# EAGLE design shield_v2 (EAGLE 6.5.0)
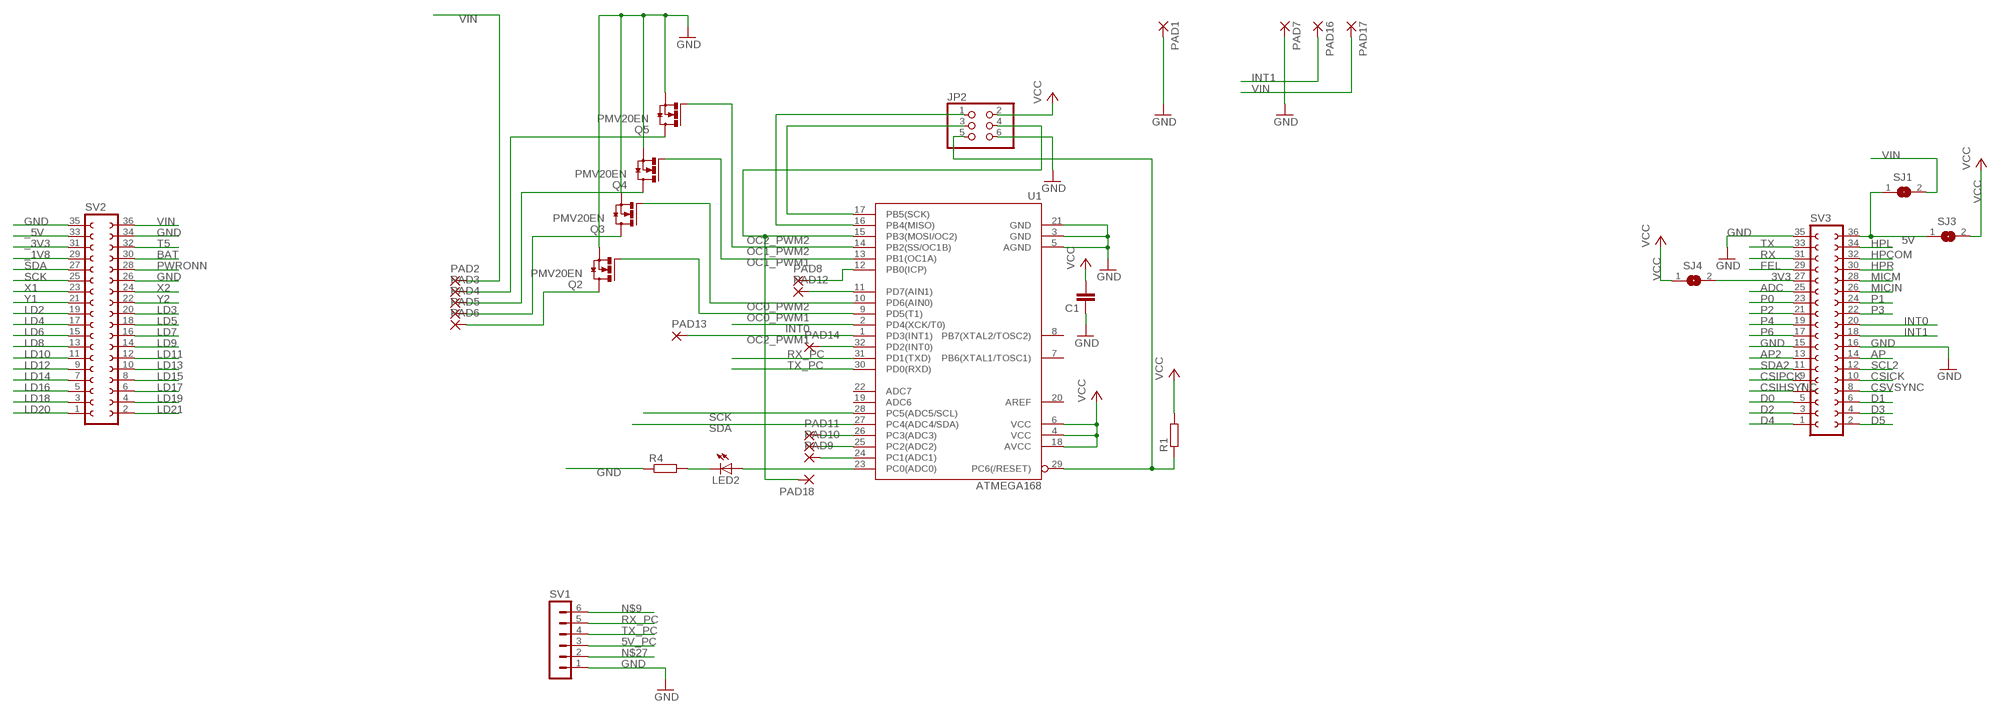
[diagram p0: schematic, sheet 1]

## Parts
C1  C-EUC0805  [C0805]
JP2  PINHD-2X3  [2X03]
LED2  LEDCHIP-LED0805  [CHIP-LED0805]
PAD1  3,17/1,3  [3,17/1,3]
PAD2  3,17/1,3  [3,17/1,3]
PAD3  3,17/1,3  [3,17/1,3]
PAD4  3,17/1,3  [3,17/1,3]
PAD5  3,17/1,3  [3,17/1,3]
PAD6  3,17/1,3  [3,17/1,3]
PAD7  3,17/1,3  [3,17/1,3]
PAD8  SMD5  [SMD2,54-5,08]
PAD9  3,17/1,3  [3,17/1,3]
PAD10  3,17/1,3  [3,17/1,3]
PAD11  3,17/1,3  [3,17/1,3]
PAD12  SMD5  [SMD2,54-5,08]
PAD13  SMD2  [SMD1,27-2,54]
PAD14  3,17/1,3  [3,17/1,3]
PAD16  3,17/1,3  [3,17/1,3]
PAD17  3,17/1,3  [3,17/1,3]
PAD18  3,17/1,3  [3,17/1,3]
Q2  PMV20EN  NMOSFET_SMD_223  [SOT223]
Q3  PMV20EN  NMOSFET_SMD_223  [SOT223]
Q4  PMV20EN  NMOSFET_SMD_223  [SOT223]
Q5  PMV20EN  NMOSFET_SMD_223  [SOT223]
R1  R-EU_M1206  [M1206]
R4  R-EU_M1206  [M1206]
SJ1  SJ  [SJ]
SJ3  SJ  [SJ]
SJ4  SJ  [SJ]
SV1  MA06-1  [MA06-1]
SV2  FE18-2  [FE18-2]
SV3  FE18-2  [FE18-2]
U1  ATMEGA168  [TQFP32-08]

## Nets
3V3: SJ4.2 SV3.27
5V: SJ1.1 SJ3.1 SV3.36
5V_PC: SV1.3
_1V8: SV2.29
_3V3: SV2.31
_5V: SV2.33
ADC: SV3.25
AP: SV3.14
AP2: SV3.13
BAT: SV2.30
CSICK: SV3.10
CSIHSYNC: SV3.7
CSIPCK: SV3.9
CSVSYNC: SV3.8
D1: SV3.6
D2: SV3.3
D3: SV3.4
D4: SV3.1
D5: SV3.2
FEL: SV3.29
GND: C1.1 JP2.6 PAD1.1(P) PAD7.1(P) Q2.3(S) Q3.3(S) Q4.3(S) Q5.3(S) R4.1 SV1.1 SV2.26 SV2.34 SV2.35 SV3.15 SV3.16 SV3.35 U1.3(GND) U1.5(AGND) U1.21(GND)
HPCOM: SV3.32
HPL: SV3.34
HPR: SV3.30
INT0: SV3.20 U1.2(PD4(XCK/T0))
INT1: PAD16.1(P) SV3.18
LD2: SV2.19
LD3: SV2.20
LD4: SV2.17
LD5: SV2.18
LD6: SV2.15
LD7: SV2.16
LD8: SV2.13
LD9: SV2.14
LD10: SV2.11
LD11: SV2.12
LD12: SV2.9
LD13: SV2.10
LD14: SV2.7
LD15: SV2.8
LD16: SV2.5
LD17: SV2.6
LD18: SV2.3
LD19: SV2.4
LD20: SV2.1
LD21: SV2.2
MICIN: SV3.26
MICM: SV3.28
N$1: JP2.5 R1.1 U1.29(PC6(/RESET))
N$2: JP2.1 U1.16(PB4(MISO))
N$3: JP2.3 U1.17(PB5(SCK))
N$4: PAD12.1(P) U1.11(PD7(AIN1))
N$5: PAD6.1(P) Q2.2(D) Q2.4(D)
N$6: PAD5.1(P) Q3.2(D) Q3.4(D)
N$7: PAD4.1(P) Q4.2(D) Q4.4(D)
N$8: PAD3.1(P) Q5.2(D) Q5.4(D)
N$9: SV1.6
N$10: PAD8.1(P) U1.12(PB0(ICP))
N$13: PAD14.1(P) U1.32(PD2(INT0))
N$15: PAD9.1(P) U1.24(PC1(ADC1))
N$16: PAD10.1(P) U1.25(PC2(ADC2))
N$17: PAD11.1(P) U1.26(PC3(ADC3))
N$23: LED2.C R4.2
N$26: LED2.A U1.23(PC0(ADC0))
N$27: SV1.2
OC0_PWM1: Q2.1(G) U1.9(PD5(T1))
OC0_PWM2: Q3.1(G) U1.10(PD6(AIN0))
OC1_PWM1: Q4.1(G) U1.13(PB1(OC1A))
OC1_PWM2: Q5.1(G) U1.14(PB2(SS/OC1B))
OC2_PWM1: PAD13.1(P) U1.1(PD3(INT1))
OC2_PWM2: JP2.4 PAD18.1(P) U1.15(PB3(MOSI/OC2))
P0: SV3.23
P1: SV3.24
P2: SV3.21
P3: SV3.22
P4: SV3.19
P6: SV3.17
PWRONN: SV2.28
RX: SV3.31
RX_PC: SV1.5 U1.31(PD1(TXD))
SCK: SV2.25 U1.28(PC5(ADC5/SCL))
SCL2: SV3.12
SDA: SV2.27 U1.27(PC4(ADC4/SDA))
SDA2: SV3.11
T5: SV2.32
TX: SV3.33
TX_PC: SV1.4 U1.30(PD0(RXD))
VCC: C1.2 JP2.2 R1.2 SJ3.2 SJ4.1 U1.4(VCC) U1.6(VCC) U1.18(AVCC)
VIN: PAD2.1(P) PAD17.1(P) SJ1.2 SV2.36
X1: SV2.23
X2: SV2.24
Y1: SV2.21
Y2: SV2.22
Unconnected: SV3.5 U1.7(PB6(XTAL1/TOSC1)) U1.8(PB7(XTAL2/TOSC2)) U1.19(ADC6) U1.20(AREF) U1.22(ADC7)

## Library data of the parts
C1 = rcl:C-EU: CAPACITOR, European symbol
JP2 = pinhead:PINHD-2X3: PIN HEADER
LED2 = led:LED: LED OSRAM: - CHIPLED LG R971, LG N971, LY N971, LG Q971, LY Q971, LO R971, LY R971 LH N974, LH R974 LS Q976, LO Q976, LY Q976 LO Q996 - Hyper CHIPLED LW Q18S LB Q993, LB Q99A, LB R99A - SideLED LS A670, LO A670, LY A670, LG A670, LP A670 LB A673, LV A673, LT A673, LW A673 LH A674 LY A675 LS A676, LA A676, LO A676, LY A676, LW A676 LS A679, LY A679, LG A679 - Hyper Micro SIDELED® LS Y876, LA Y876, LO Y876, LY Y876 LT Y87S - SmartLED LW L88C, LW L88S LB L89C, LB L89S, LG L890 LS L89K, LO L89K, LY L89K LS L896, LA L896, LO L896, LY L896 - TOPLED LS T670, LO T670, LY T670, LG T670, LP T670 LSG T670, LSP T670, LSY T670, LOP T670, LYG T670 LG T671, LOG T671, LSG T671 LB T673, LV T673, LT T673, LW T673 LH T674 LS T676, LA T676, LO T676, LY T676, LB T676, LH T676, LSB T676, LW T676 LB T67C, LV T67C, LT T67C, LS T67K, LO T67K, LY T67K, LW E67C LS E67B, LA E67B, LO E67B, LY E67B, LB E67C, LV E67C, LT E67C LW T67C LS T679, LY T679, LG T679 LS T770, LO T770, LY T770, LG T770, LP T770 LB T773, LV T773, LT T773, LW T773 LH T774 LS E675, LA E675, LY E675, LS T675 LS T776, LA T776, LO T776, LY T776, LB T776 LHGB T686 LT T68C, LB T68C - Hyper Mini TOPLED® LB M676 - Mini TOPLED Santana® LG M470 LS M47K, LO M47K, LY M47K Source: http://www.osram.convergy.de LUXEON: - LUMILED® LXK2-PW12-R00, LXK2-PW12-S00, LXK2-PW14-U00, LXK2-PW14-V00 LXK2-PM12-R00, LXK2-PM12-S00, LXK2-PM14-U00 LXK2-PE12-Q00, LXK2-PE12-R00, LXK2-PE12-S00, LXK2-PE14-T00, LXK2-PE14-U00 LXK2-PB12-K00, LXK2-PB12-L00, LXK2-PB12-M00, LXK2-PB14-N00, LXK2-PB14-P00, LXK2-PB14-Q00 LXK2-PR12-L00, LXK2-PR12-M00, LXK2-PR14-Q00, LXK2-PR14-R00 LXK2-PD12-Q00, LXK2-PD12-R00, LXK2-PD12-S00 LXK2-PH12-R00, LXK2-PH12-S00 LXK2-PL12-P00, LXK2-PL12-Q00, LXK2-PL12-R00 Source: www.luxeon.com KINGBRIGHT: KA-3528ASYC Source: www.kingbright.com
PAD1-PAD7 PAD9-PAD11 PAD14 PAD16-PAD18 = wirepad:3,17/1,3: THROUGH-HOLE PAD
PAD8 PAD12 = wirepad:SMD5: SMD PAD
PAD13 = wirepad:SMD2: SMD PAD
Q2-Q5 = transistor-power:NMOSFET_SMD_223
R1 R4 = rcl:R-EU_: RESISTOR, European symbol
SJ1 SJ3 SJ4 = jumper:SJ: SMD solder JUMPER
SV1 = con-lstb:MA06-1: PIN HEADER; OC_FARNELL: unknown; OC_NEWARK: unknown
SV2 SV3 = con-lsta:FE18-2: FEMALE HEADER; OC_FARNELL: unknown; OC_NEWARK: unknown
U1 = SparkFun-DigitalIC:ATMEGA168: Atmel 32-pin 8-bit micro, 16k flash.

## Board
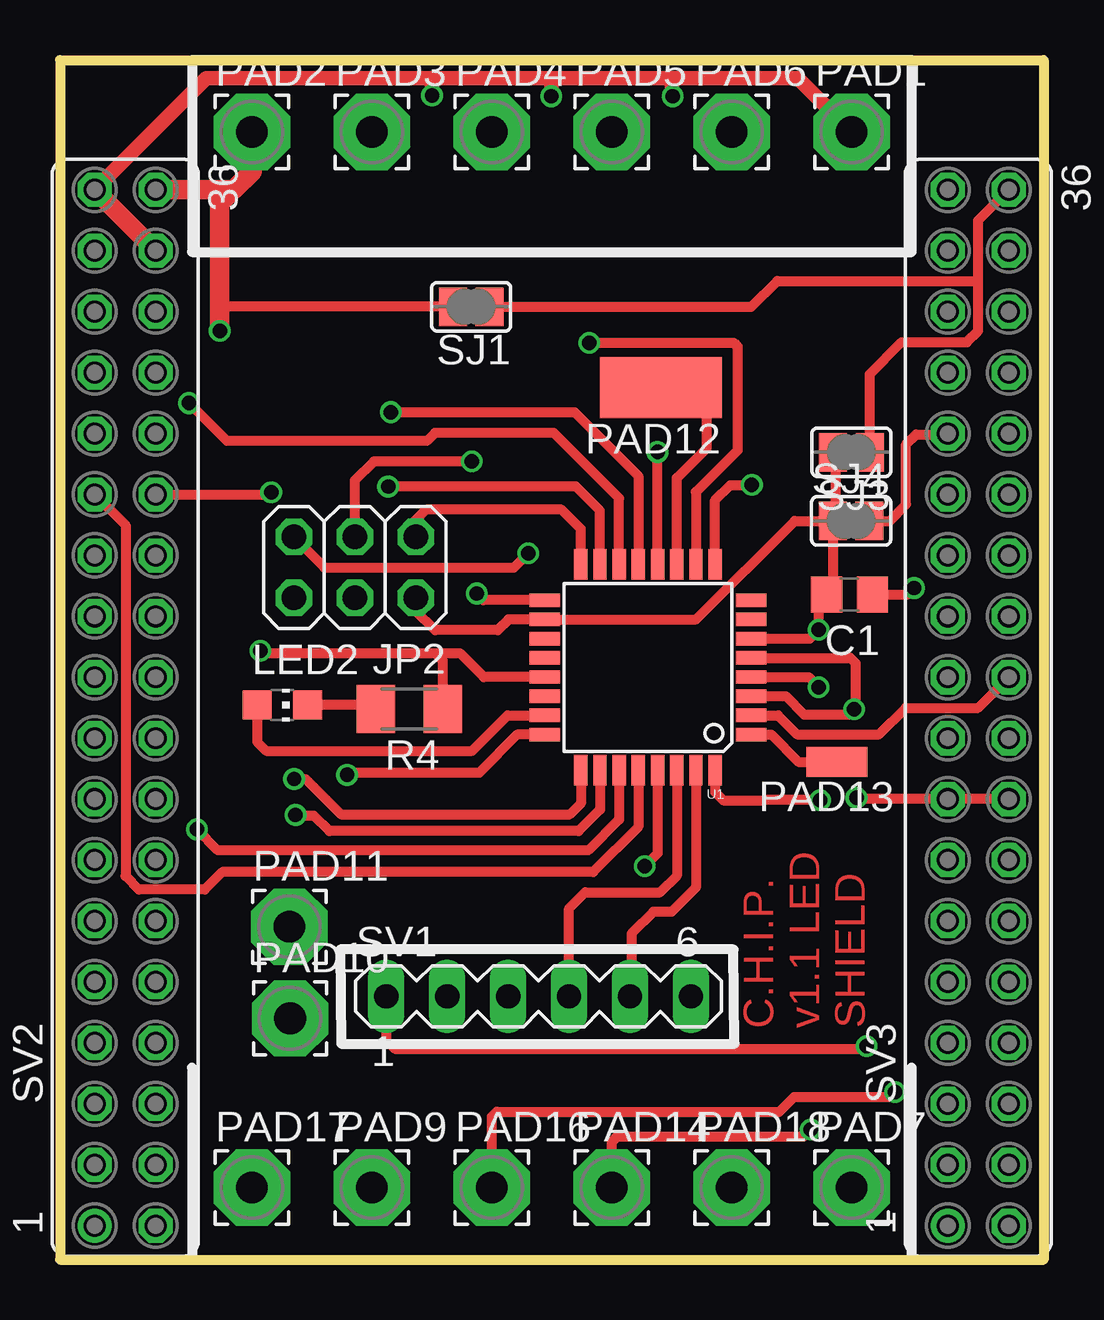
[diagram p1: board, top side]
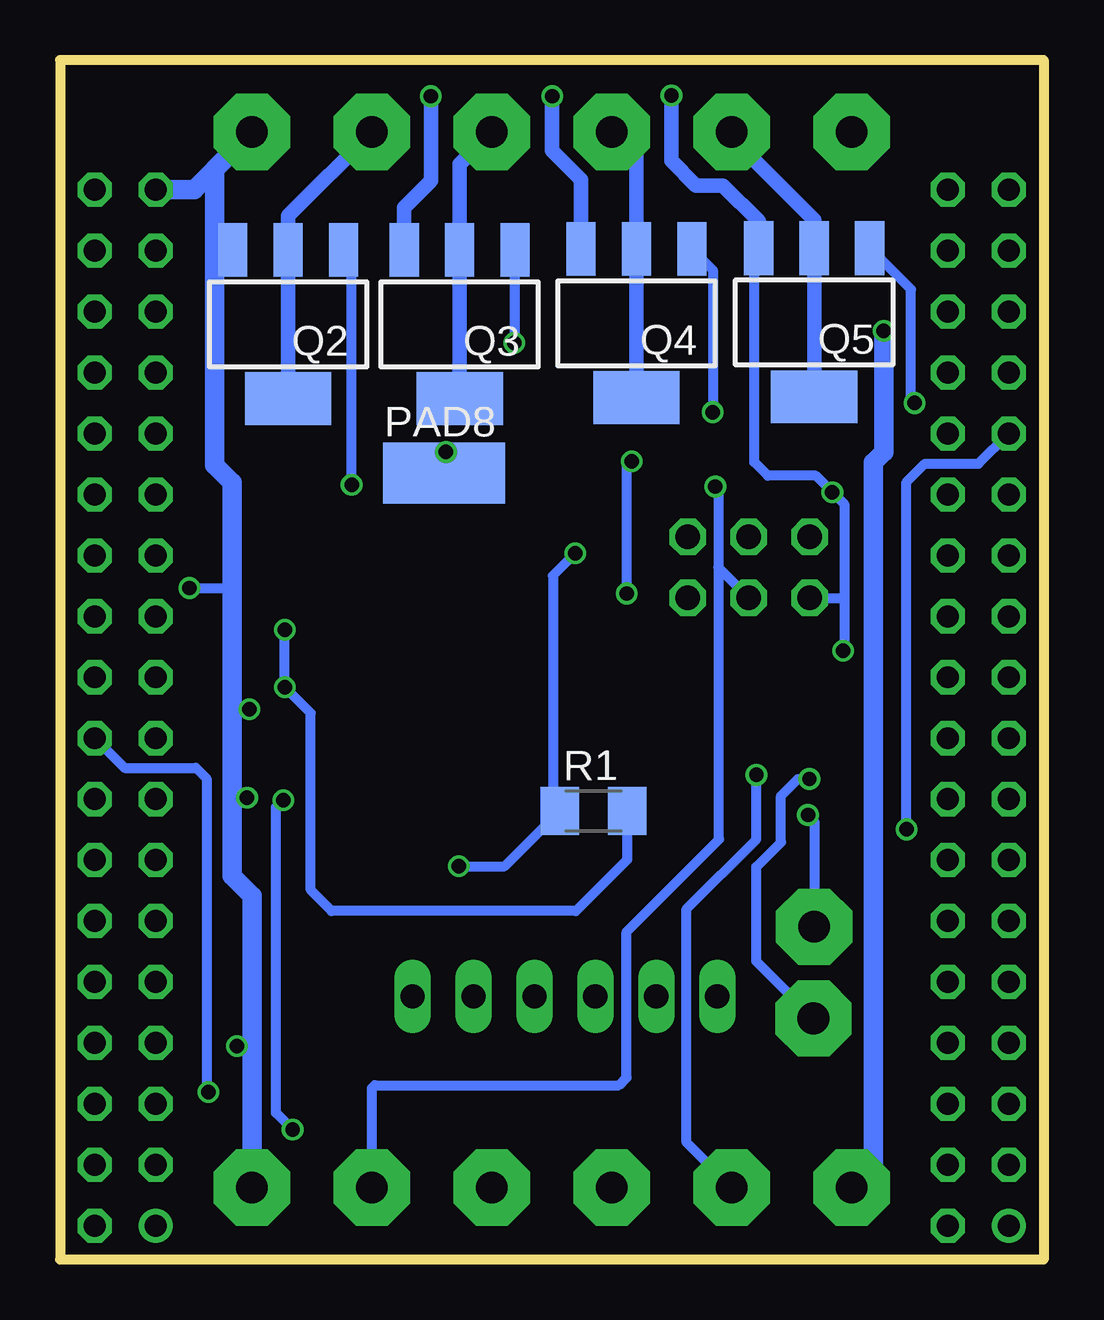
[diagram p2: board, bottom side, seen from below]

Size 41 x 50 mm. Coordinates in mm from the lower left corner, seen from the top.
Outline: 0,50 41,50 41,0 0,0 0,50
Copper layers (1*16): Top 0.035mm / dielectric 1.5mm / Bottom 0.035mm
Design rules "SeeedStudio_2layer_DRU_no_angle_20140221": minimum track width 6mil, minimum drill 12mil, track to track 6mil, track to pad 6mil, pad to pad 6mil, via to via 6mil, smd to smd 0mil, copper to edge 10mil, drill to drill 10mil, minimum pad ring 10mil, minimum via ring 6mil, stop-mask expansion 2mil, vias tented up to drill 100mil, thermal gap 10mil
tRestrict: area 21.3,21.5 to 27.7,26.1

### Footprints (pad centres in the part's own frame; a part is rotated, then mirrored left to right if it is on the bottom)
C0805 = smd 1.3 x 1.5: 1 -0.95,0; 2 0.95,0
2X03 = drill 1.016 octagon: 1 -2.54,-1.27; 2 -2.54,1.27; 3 0,-1.27; 4 0,1.27; 5 2.54,-1.27; 6 2.54,1.27
CHIP-LED0805 = smd 1.2 x 1.2: A 0,-1.05; C 0,1.05
3,17/1,3 = drill 1.321 pad 3.175 octagon: 1 0,0
SMD2,54-5,08 = smd 2.54 x 5.08: 1 0,0
SMD1,27-2,54 = smd 1.27 x 2.54: 1 0,0
SOT223 = smd 1.219 x 2.235: 1 -2.311,-3.099; 2 0,-3.099; 3 2.311,-3.099 | smd 3.6 x 2.2: 4 0,3.099
M1206 = smd 1.6 x 2: 1 -1.4,0; 2 1.4,0
SJ = smd 1.168 x 1.6: 1 -0.762,0; 2 0.762,0
MA06-1 = drill 1.016 long: 1 -6.35,0; 2 -3.81,0; 3 -1.27,0; 4 1.27,0; 5 3.81,0; 6 6.35,0
FE18-2 = drill 0.914: 1 -21.59,1.27 | drill 0.914 octagon: 2 -21.59,-1.27; 3 -19.05,1.27; 4 -19.05,-1.27; 5 -16.51,1.27; 6 -16.51,-1.27; 7 -13.97,1.27; 8 -13.97,-1.27; 9 -11.43,1.27; 10 -11.43,-1.27; 11 -8.89,1.27; 12 -8.89,-1.27; 13 -6.35,1.27; 14 -6.35,-1.27; 15 -3.81,1.27; 16 -3.81,-1.27; 17 -1.27,1.27; 18 -1.27,-1.27; 19 1.27,1.27; 20 1.27,-1.27; 21 3.81,1.27; 22 3.81,-1.27; 23 6.35,1.27; 24 6.35,-1.27; 25 8.89,1.27; 26 8.89,-1.27; 27 11.43,1.27; 28 11.43,-1.27; 29 13.97,1.27; 30 13.97,-1.27; 31 16.51,1.27; 32 16.51,-1.27; 33 19.05,1.27; 34 19.05,-1.27; 35 21.59,1.27; 36 21.59,-1.27
TQFP32-08 = smd 1.27 x 0.559: 1 -4.293,2.8; 2 -4.293,2; 3 -4.293,1.2; 4 -4.293,0.4; 5 -4.293,-0.4; 6 -4.293,-1.2; 7 -4.293,-2; 8 -4.293,-2.8; 17 4.293,-2.8; 18 4.293,-2; 19 4.293,-1.2; 20 4.293,-0.4; 21 4.293,0.4; 22 4.293,1.2; 23 4.293,2; 24 4.293,2.8 | smd 0.559 x 1.27: 9 -2.8,-4.293; 10 -2,-4.293; 11 -1.2,-4.293; 12 -0.4,-4.293; 13 0.4,-4.293; 14 1.2,-4.293; 15 2,-4.293; 16 2.8,-4.293; 25 2.8,4.293; 26 2,4.293; 27 1.2,4.293; 28 0.4,4.293; 29 -0.4,4.293; 30 -1.2,4.293; 31 -2,4.293; 32 -2.8,4.293

### Placement (x,y rotation side)
C1  32.91,27.72 180 top
JP2  12.29,28.85 180 top
LED2  9.27,23.11 270 top
PAD1  33,47 0 top
PAD2  8,47 0 top
PAD3  13,47 0 top
PAD4  18,47 0 top
PAD5  23,47 0 top
PAD6  28,47 0 top
PAD7  33,3 0 top
PAD8  24.99,32.79 270 bottom
PAD9  13,3 0 top
PAD10  9.59,10.05 0 top
PAD11  9.56,13.87 0 top
PAD12  25.06,36.35 90 top
PAD13  32.39,20.74 90 top
PAD14  23,3 0 top
PAD16  18,3 0 top
PAD17  8,3 0 top
PAD18  28,3 0 top
Q2  31.49,38.98 180 bottom
Q3  24.34,38.98 180 bottom
Q4  16.97,39.02 180 bottom
Q5  9.56,39.06 180 bottom
R1  18.76,18.7 0 bottom
R4  14.56,22.95 180 top
SJ1  17.14,39.71 180 top
SJ3  32.99,33.65 180 top
SJ4  32.98,30.79 0 top
SV1  19.95,10.97 0 top
SV2  2.72,23 90 top
SV3  38.28,23 90 top
U1  24.51,24.68 180 top

### Tracks (layer width: path | path; a pad name or v marks a point on that pad's centre or on a via)
3V3
  Top 0.406: SJ4.2 34.59,30.79 35.27,31.47 35.27,33.97 35.69,34.39 36.97,34.39 SV3.27
5V
  Top 0.406: SJ3.1 33.75,36.9 35.08,38.23 37.81,38.23 38.28,38.7 38.28,40.8 | 38.28,40.8 38.28,43.32 SV3.36 | SJ1.1 28.82,39.71 29.9,40.79 38.27,40.79 arc90 38.28,40.8
GND  (via drill 0.6)
  Top 0.406: U1.21 17.67,24.28 16.67,25.28 15.63,25.28 | U1.3 30.25,23.48 31.02,22.71 32.87,22.71 v33.1,22.94 33.16,23 33.16,24.86 32.94,25.08 U1.5 | SV1.1 13.6,9.14 13.95,8.79 33.52,8.79 v33.63,8.9 | 15.63,25.28 8.46,25.28 v8.36,25.38 | R4.1 15.96,24.95 15.63,25.28 | SV2.26 8.71,31.89 v8.8,31.98 | SV3.16 SV3.15 33.26,19.19 v33.2,19.25 | C1.1 35.34,27.72 v35.61,27.99
  Top 0.61: SV2.35 6.09,49.23 15.51,49.23 | 15.51,49.23 20.46,49.23 | 20.46,49.23 25.51,49.23 | 25.51,49.23 30.77,49.23 PAD1.1 | v25.54,48.49 25.51,48.52 25.51,49.23 | v20.48,48.49 20.48,49.21 20.46,49.23 | v15.51,48.52 15.51,49.23
  Top 0.813: SV2.35 SV2.34
  Bottom 0.406: 33.81,24.19 33.82,24.18 | v33.1,22.94 33.82,22.94 | v33.63,8.9 33.03,8.9 33,8.93 | JP2.6 8.4,27.58 8.36,27.54 8.31,27.54 | Q5.3 12.06,41.97 12.06,33.23 11.5,32.67 9.49,32.67 v8.8,31.98 8.31,31.49 8.31,27.54 | 34.53,39.14 34.56,39.11 | v33.2,19.25 33.79,19.25 33.82,19.28 | v35.61,27.99 33.99,27.99 33.82,28.16 | 8.31,27.54 8.31,25.43 v8.36,25.38
  Bottom 0.61: Q3.3 26.65,43.85 25.54,44.96 v25.54,48.49 | Q4.3 19.28,45.01 20.49,46.22 v20.49,48.48 v20.48,48.49 | Q5.3 11.87,43.28 13.36,44.77 14.48,44.77 15.51,45.8 v15.51,48.52
  Bottom 0.813: PAD7.1 33,8.93 33,15.16 33.82,15.98 33.82,19.28 33.82,22.94 33.82,24.18 33.82,28.16 33.82,32.38 34.56,33.12 34.56,39.11 34.56,42.21 | 34.56,42.21 34.56,45.44 | 34.56,45.44 PAD1.1 | Q2.3 34.43,42.08 34.56,42.21 | 34.56,45.44 35.41,44.59 SV3.35
INT0
  Top 0.406: U1.2 29.93,22.68 30.72,21.89 34.14,21.89 35.25,23 38.28,23 SV3.20
INT1  (via drill 0.6)
  Top 0.406: PAD16.1 18,5.96 18.2,6.16 29.99,6.16 30.61,6.78 34.61,6.78 v34.81,6.98
  Bottom 0.406: 34.9,7.07 v34.81,6.98 34.89,7.06 34.89,20.05 35.33,20.49 38.31,20.49 SV3.18
N$1  (via drill 0.6)
  Top 0.406: JP2.5 11.03,28.84 18.92,28.84 v19.52,29.44 | U1.29 24.91,16.93 v24.37,16.39
  Bottom 0.406: v19.52,29.44 20.45,28.51 20.45,18.99 R1.1 | 21.02,17.84 R1.1 | R1.1 22.47,16.39 v24.37,16.39
N$2
  Top 0.406: U1.16 21.71,30.45 20.9,31.26 15.26,31.26 14.72,30.72 14.72,30.23 JP2.1
N$3  (via drill 0.6)
  Top 0.406: U1.17 17.65,27.48 v17.37,27.76 | v17.17,33.27 13.09,33.27 12.29,32.47 JP2.3
  Bottom 0.406: v17.37,27.76 17.37,33.07 v17.17,33.27
N$4
  Top 0.406: U1.11 25.71,32.58 26.96,33.83 26.96,36.2 26.84,36.32 25.09,36.32 PAD12.1
N$5
  Bottom 0.61: PAD6.1 31.49,43.51 Q2.2 Q2.4
N$6
  Bottom 0.61: PAD5.1 24.34,45.66 Q3.2 Q3.4
N$7
  Bottom 0.61: Q4.4 Q4.2 16.97,45.97 PAD4.1
N$8
  Bottom 0.61: Q5.4 Q5.2 9.56,43.33 13,46.77 PAD3.1
N$10  (via drill 0.6)
  Top 0.406: U1.12 v24.91,33.66
  Bottom 0.152: 25.3,33.12 25.4,33.02 PAD8.1
  Bottom 0.406: 25.41,33.23 25.3,33.12 24.99,32.81 v24.91,33.66 24.89,32.89 24.89,32.92 25.34,33.37
N$13  (via drill 0.6)
  Top 0.406: U1.32 27.31,19.48 27.65,19.14 29.34,19.14 29.36,19.16 29.37,19.15 v31.69,19.15 | PAD14.1 23,4.91 23.22,5.13 31.01,5.13 v31.3,5.42
  Bottom 0.406: v31.3,5.42 31.99,6.11 31.99,18.85 v31.69,19.15
N$15  (via drill 0.6)
  Top 0.406: U1.24 19.06,21.88 17.47,20.29 12.06,20.29 v11.97,20.2
  Bottom 0.406: 12.05,20.12 v11.97,20.2 11.97,17.52 14.88,14.61 14.88,4.88 PAD9.1
N$16  (via drill 0.6)
  Top 0.406: U1.25 21.71,19.02 21.25,18.56 11.71,18.56 10.24,20.03 v9.76,20.03
  Bottom 0.406: PAD10.1 11.97,12.43 11.97,16.37 10.95,17.39 10.95,19.32 10.24,20.03 v9.76,20.03
N$17  (via drill 0.6)
  Top 0.406: U1.26 22.52,20.38 22.52,18.76 21.62,17.86 11.23,17.86 10.59,18.5 9.85,18.5 v9.82,18.53
  Bottom 0.406: v9.82,18.53 9.56,18.27 PAD11.1
N$23
  Top 0.406: R4.2 13,23.11 LED2.C
N$26
  Top 0.406: LED2.A 8.22,21.58 8.6,21.2 17.18,21.2 18.66,22.68 U1.23
OC0_PWM1  (via drill 0.6)
  Top 0.406: U1.9 27.31,31.65 27.94,32.28 v28.83,32.28 v28.84,32.29
  Bottom 0.406: v28.84,32.29 28.84,41.74 Q2.1
OC0_PWM2  (via drill 0.6)
  Top 0.406: U1.10 26.51,31.99 28.24,33.72 28.24,38.06 28.09,38.21 v22.06,38.21
  Bottom 0.406: Q3.1 22.06,42.05 v22.06,38.21
OC1_PWM1  (via drill 0.6)
  Top 0.406: v13.79,35.32 21.45,35.32 24.11,32.66 U1.13
  Bottom 0.406: Q4.1 13.79,41.25 v13.79,35.32
OC1_PWM2  (via drill 0.6)
  Top 0.406: U1.14 23.31,31.73 20.59,34.45 15.63,34.45 15.3,34.12 6.96,34.12 v5.38,35.7
  Bottom 0.406: v5.38,35.7 5.53,35.85 5.53,40.44 Q5.1
OC2_PWM1
  Top 0.406: U1.1 29.65,21.88 30.79,20.74 PAD13.1
OC2_PWM2  (via drill 0.6)
  Top 0.406: U1.15 22.51,31.21 21.5,32.22 v13.68,32.22
  Bottom 0.406: v13.68,32.22 13.56,32.1 13.56,28.85 13.53,28.82 | 13.53,28.82 JP2.4 | PAD18.1 28,7.15 27.88,7.27 17.7,7.27 17.38,7.59 17.38,13.66 13.53,17.52 13.53,28.82
RX_PC
  Top 0.406: SV1.5 23.83,11.04 23.83,13.59 24.73,14.49 25.49,14.49 26.51,15.51 U1.31
SCK
  Top 0.406: SV2.25 2.73,30.61 2.73,15.98 3.29,15.42 6.04,15.42 6.77,16.15 22.22,16.15 24.11,18.04 U1.28
SDA  (via drill 0.6)
  Top 0.406: U1.27 23.31,18.34 22.03,17.06 6.58,17.06 v5.71,17.93
  Bottom 0.406: v5.71,17.93 5.71,32.4 4.94,33.17 2.71,33.17 SV2.27
TX_PC
  Top 0.406: U1.30 25.71,16 25.02,15.31 21.89,15.31 21.22,14.64 SV1.4
VCC  (via drill 0.6)
  Top 0.406: U1.4 31.21,24.28 v31.63,23.86 | 32.34,30.17 32.34,33.54 SJ3.2 | SJ4.1 32.34,30.17 | 32.34,30.17 32.32,30.15 | U1.6 31.26,25.88 v31.63,26.25 31.63,27.31 | SJ4.1 30.63,30.79 26.52,26.68 U1.18 18.69,26.68 18.24,26.23 15.64,26.23 14.83,27.04 JP2.2 | 31.63,27.31 31.63,27.39 C1.2 | SJ4.1 32.22,27.9 31.63,27.31
  Bottom 0.406: v31.63,26.25 v31.63,23.86 30.55,22.78 30.55,15.4 29.68,14.53 19.49,14.53 17.36,16.66 R1.2
VIN  (via drill 0.6)
  Top 0.406: SJ1.2 6.89,39.71 6.66,39.48
  Top 0.813: PAD2.1 8,45.35 7.24,44.59 | 7.24,44.59 SV2.36 | v6.66,38.71 6.66,39.48 6.66,44.01 7.24,44.59
  Bottom 0.813: PAD17.1 7.1,3.9 7.1,33.21 6.66,33.65 v6.66,38.71

### Text on the board
Top: C.H.I.P. / v1.1 LED / SHIELD
Dimension: Ordered at Seeedstudio / Jan/2016 as v1.1 for the / Forum
tStop: 9:ADC | PC_TX | PC_RX | 8:ADC
bStop: 5V | 0:PWM | 1:PWM | 2:PWM | 3:PWM | GND | 5V | 4:ADC | 5:C_IN | 6:A_IN | 7:NEO | GND